# EAGLE design rapidshark-half-assed-half-h-bridge-mk-1.4 (EAGLE 7.5.0)
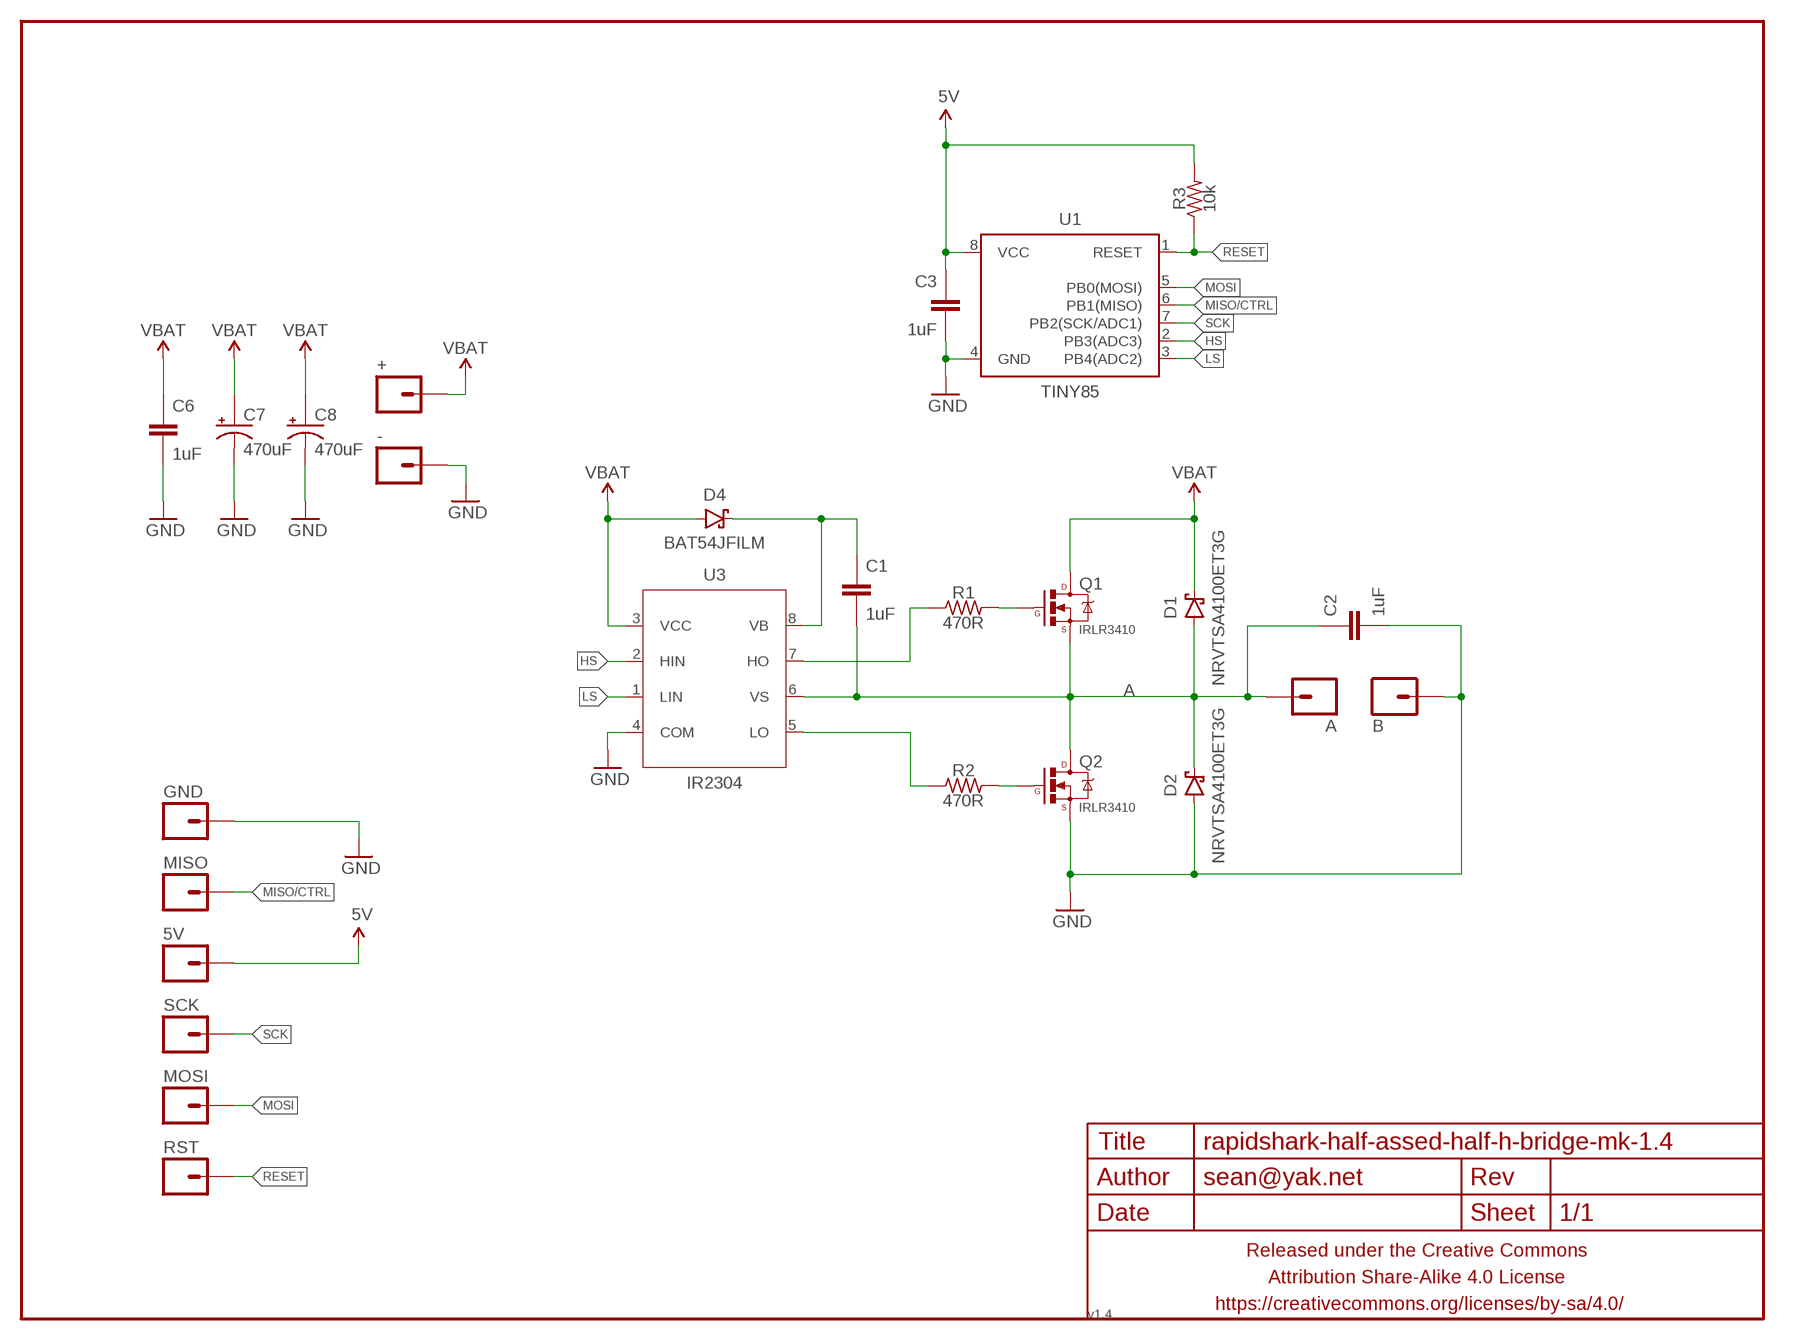
[diagram p0: schematic, sheet 1]

## Parts
5V  M01PTH-0.9MM  [1X01-0.9MM]
+  M01PTH-1.4MM  [1X01-1.4MM-CIR]
-  M01PTH-1.4MM  [1X01-1.4MM-CIR]
A  M01PTH-1.4MM  [1X01-1.4MM-CIR]
B  M01PTH-1.4MM  [1X01-1.4MM-CIR]
C1  1uF  CAPACITOR-CERAMICC0603-TIGHTER  [C0603-TIGHTER]
C2  1uF  CAPACITOR-CERAMICC0603-TIGHTER  [C0603-TIGHTER]
C3  1uF  CAPACITOR-CERAMICC0603-TIGHTER  [C0603-TIGHTER]
C6  1uF  CAPACITOR-CERAMICC0603-TIGHTER  [C0603-TIGHTER]
C7  470uF  CAPACITOR-POLARIZEDE5-10.5  [E5-10,5]
C8  470uF  CAPACITOR-POLARIZEDE5-10.5  [E5-10,5]
D1  NRVTSA4100ET3G  DIODE-SCHOTTKYSMA  [SMA-DIODE-SCHOTTKY]
D2  NRVTSA4100ET3G  DIODE-SCHOTTKYSMA  [SMA-DIODE-SCHOTTKY]
D4  BAT54JFILM  DIODE-SCHOTTKYSOD323  [SOD323-SCHOTTKY]
FRAME1  FRAME-LETTERNO_PACKAGE  [DUMMY]
GND  M01PTH-0.9MM  [1X01-0.9MM]
MISO  M01PTH-0.9MM  [1X01-0.9MM]
MOSI  M01PTH-0.9MM  [1X01-0.9MM]
Q1  IRLR3410  MOSFET-NCHANNELFDD8780  [DPAK]
Q2  IRLR3410  MOSFET-NCHANNELFDD8780  [DPAK]
R1  470R  RESISTORR0603-TIGHTER  [R0603-TIGHTER]
R2  470R  RESISTORR0603-TIGHTER  [R0603-TIGHTER]
R3  10k  RESISTORR0603-TIGHTER  [R0603-TIGHTER]
RST  M01PTH-0.9MM  [1X01-0.9MM]
SCK  M01PTH-0.9MM  [1X01-0.9MM]
U1  TINY85  ATTINY45TINY85-20-SOICW  [SO08-EIAJ]
U3  IR2304  IR2304SSOIC  [SO08]

## Nets
5V: 5V.1 C3.1 R3.2 U1.8(VCC)
A: A.P$1 C1.2 C2.1 D1.A D2.C Q1.3(S) Q2.4(D) U3.6(VS)
GND: -.P$1 B.P$1 C2.2 C3.2 C6.2 C7.- C8.- D2.A GND.1 Q2.3(S) U1.4(GND) U3.4(COM)
HS: U1.2(PB3(ADC3)) U3.2(HIN)
LS: U1.3(PB4(ADC2)) U3.1(LIN)
MISO/CTRL: MISO.1 U1.6(PB1(MISO))
MOSI: MOSI.1 U1.5(PB0(MOSI))
N$1: Q1.1(G) R1.2
N$2: Q2.1(G) R2.2
N$3: R1.1 U3.7(HO)
N$4: R2.1 U3.5(LO)
N$5: C1.1 D4.C U3.8(VB)
RESET: R3.1 RST.1 U1.1(RESET)
SCK: SCK.1 U1.7(PB2(SCK/ADC1))
VBAT: +.P$1 C6.1 C7.+ C8.+ D1.C D4.A Q1.4(D) U3.3(VCC)

## Library data of the parts
5V + - A B GND MISO MOSI RST SCK = a_parts:M01: Header 1 Standard 1-pin 0.1" header. Use with straight break away headers (SKU : PRT-00116), right angle break away headers (PRT-00553), swiss pins (PRT-00743), machine pins (PRT-00117), and female headers (PRT-00115).
C1-C3 C6 = a_parts:CAPACITOR-CERAMIC: CAPACITOR, European symbol
C7 C8 = a_parts:CAPACITOR-POLARIZED: POLARIZED CAPACITOR, American symbol
D1 D2 D4 = a_parts:DIODE-SCHOTTKY: Schottky diodes in SFE's production catalog BAT20J 1A 23V 0.62Vf RB751 120mA 40V 0.37Vf PMEG4005EJ 0.5A 40V 0.42Vf MBRA140 1A 40V 0.5Vf B340A 3A 40V SMA
FRAME1 = A_butts:FRAME-LETTER: Schematic Frame Standard 8.5x11 US Letter frame; DESIGNER: sean@yak.net; VERSION: v1.4
Q1 Q2 = a_parts:MOSFET-NCHANNEL: Common NMOSFET Parts MFG P/N Store ID Prod ID FDD8780 TRANS-09984 SI7820DN TRANS-11055 FDS6630A IC-08089 2N7002PW TRANS-11151 FQP30N06L COM-10213 TRANS-10060 BSS123LT1G TRANS-08345 BSS138 TRANS-00830 BS170 2N7000; PROD_ID: TRANS-09984
R1-R3 = a_parts:RESISTOR: RESISTOR, American symbol
U1 = a_parts:ATTINY45: Atmel 8-pin 2/4/8kB flash uC; PROD_ID: IC-09092; VALUE: Tiny85-20-SMT
U3 = a_parts:IR2304S

## Board
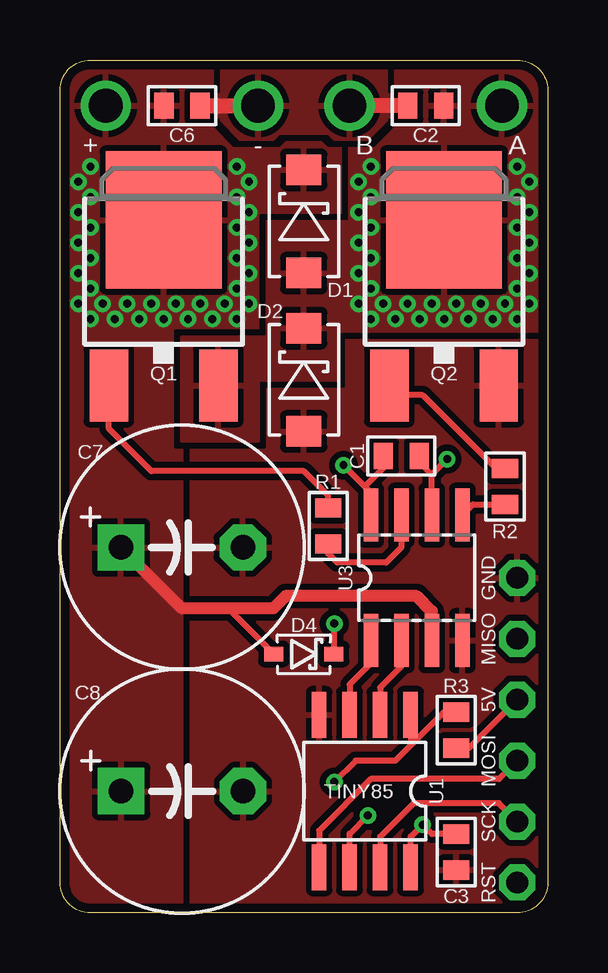
[diagram p1: board, top side]
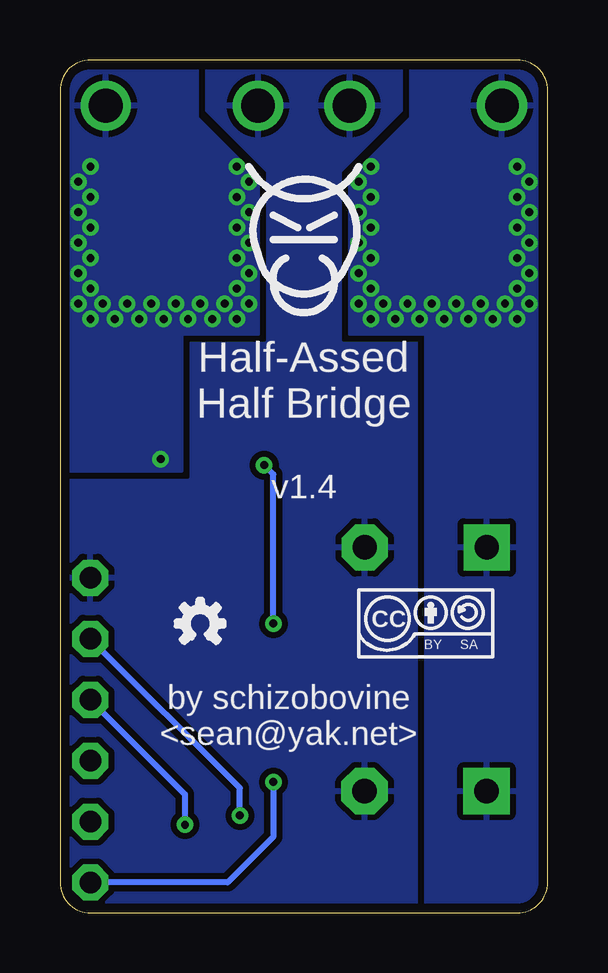
[diagram p2: board, bottom side, seen from below]

Size 20.32 x 35.56 mm. Coordinates in mm from the lower left corner, seen from the top.
Outline: 1.27,35.56 19.05,35.56 arc-90 20.32,34.29 20.32,1.27 arc-90 19.05,0 1.27,0 arc-90 0,1.27 0,34.29 arc-90 1.27,35.56
Copper layers (1*16): Top 0.0356mm / dielectric 1.5011mm / Bottom 0.0356mm
Design rules "LaenPCBOrder_2": minimum track width 6mil, minimum drill 13mil, track to track 6mil, track to pad 6mil, pad to pad 6mil, via to via 6mil, smd to smd 6mil, copper to edge 15mil, drill to drill 6mil, minimum pad ring 7mil, minimum via ring 7mil, stop-mask expansion 3mil, vias tented up to drill 20mil, thermal gap 10mil

### Footprints (pad centres in the part's own frame; a part is rotated, then mirrored left to right if it is on the bottom)
1X01-0.9MM = drill 0.9 pad 1.5 octagon: 1 0,0
1X01-1.4MM-CIR = drill 1.4 pad 2.1: P$1 0,0
C0603-TIGHTER = smd 0.8 x 1.1: 1 -0.75,0; 2 0.75,0
E5-10,5 = drill 1.016 pad 1.93 square: + -2.54,0 | drill 1.016 pad 1.93 octagon: - 2.54,0
SMA-DIODE-SCHOTTKY = smd 1.27 x 1.47: A -2.15,0; C 2.15,0
SOD323-SCHOTTKY = smd 0.8 x 0.6: A -1.25,0; C 1.25,0
DPAK = smd 1.6 x 3: 1 -2.28,-5.31; 3 2.28,-5.31 | smd 4.826 x 5.715: 4 0,1.588
R0603-TIGHTER = smd 0.8 x 1.1: 1 -0.75,0; 2 0.75,0
SO08-EIAJ = smd 0.61 x 1.905: 1 -1.905,-3.175; 2 -0.635,-3.175; 3 0.635,-3.175; 4 1.905,-3.175; 5 1.905,3.175; 6 0.635,3.175; 7 -0.635,3.175; 8 -1.905,3.175
SO08 = smd 0.61 x 2.21: 1 -1.905,-2.616; 2 -0.635,-2.616; 3 0.635,-2.616; 4 1.905,-2.616; 5 1.905,2.616; 6 0.635,2.616; 7 -0.635,2.616; 8 -1.905,2.616

### Placement (x,y rotation side)
5V  19.05,8.89 90 top
+  1.91,33.66 0 top
-  8.26,33.66 0 top
A  18.41,33.66 0 top
B  12.06,33.66 0 bottom
C1  14.22,19.05 0 top
C2  15.24,33.66 180 top
C3  16.51,2.54 270 top
C6  5.08,33.66 0 top
C7  5.08,15.24 0 top
C8  5.09,5.08 0 top
D1  10.16,28.83 90 top
D2  10.16,22.23 90 top
D4  10.16,10.79 0 top
FRAME1  0,0 0 top
GND  19.05,13.97 90 top
MISO  19.05,11.43 90 top
MOSI  19.05,6.35 90 top
Q1  4.32,27.3 0 top
Q2  16,27.3 0 top
R1  11.18,16.13 90 top
R2  18.54,17.78 90 top
R3  16.51,7.62 270 top
RST  19.05,1.27 90 top
SCK  19.05,3.81 90 top
U1  12.7,5.08 180 top
U3  14.86,13.97 0 top
U$1  [COW_SMALL_NOTEXT]  10.16,28.57 0 bottom
U$2  [CC-BY-SA-4.0-NO-URL]  5.08,12.06 0 bottom
U$3  [OSHWLOGO_TINY_SILKONLY]  14.48,12.06 0 bottom

### Tracks (layer width: path | path; a pad name or v marks a point on that pad's centre or on a via)
5V  (via drill 0.33)
  Top 0.254: R3.2 17.03,6.87 5V.1 | U1.8 14.61,3.17 v15.11,3.68 15.51,3.29 C3.1
  Bottom 0.254: 5V.1 15.11,4.95 v15.11,3.68
A  (via drill 0.33)
  Top 0.254: C1.2 14.99,19.04 14.99,18.8 15.49,18.29 | U3.6 15.49,18.29 | 15.49,18.29 v16.13,18.92
  other vias: 12.95,26.04 12.45,26.67 18.03,24.77 17.53,25.4 12.45,27.94 12.45,29.21 12.45,30.48 12.95,27.3 12.95,28.57 12.95,29.84 12.95,31.11 12.45,25.4 12.95,24.77 13.46,25.4 13.97,24.77 14.48,25.4 14.99,24.77 15.49,25.4 16,24.77 16.51,25.4 17.02,24.77 18.54,25.4 19.05,24.77 19.56,25.4 19.56,26.67 19.56,27.94 19.56,29.21 19.56,30.48 19.05,26.04 19.05,27.3 19.05,28.57 19.05,29.84 19.05,31.11
  pour Top (isolate 0.254, rank 4): 12.06,35.56 12.06,28.83 8.64,28.83 8.64,24 5.08,24 5.08,19.68 8.26,19.68 8.26,22.23 11.56,22.23 11.56,24.26 20.32,24.26 20.32,34.29 arc90 19.05,35.56
  pour Bottom (isolate 0.254, rank 5): 14.61,35.56 19.05,35.56 arc-90 20.32,34.29 20.32,18.41 15.24,18.41 15.24,24.13 12.06,24.13 12.06,30.61 14.61,33.15
GND
  Top 0.635: C6.2 -.P$1 | C2.2 B.P$1
  pour Bottom (isolate 0.254, rank 6): 20.32,34.29 20.32,1.27 arc-90 19.05,0 1.27,0 arc-90 0,1.27 0,34.29 arc-90 1.27,35.56 19.05,35.56 arc-90
  pour Top (rank 2): 6.73,35.56 6.73,33.02 7.49,32.26 8.89,32.26 9.14,32.51 11.18,32.51 11.43,32.26 12.83,32.26 13.59,33.02 13.59,35.56
  pour Top (isolate 0.254, rank 6): 0,34.29 0,1.27 arc90 1.27,0 19.05,0 arc90 20.32,1.27 20.32,34.29 arc90 19.05,35.56 1.27,35.56 arc90
HS
  Top 0.254: U3.2 14.22,10.29 13.34,9.4 U1.2
LS
  Top 0.254: U3.1 12.95,10.41 12.06,9.53 U1.3
MISO/CTRL  (via drill 0.33)
  Top 0.254: U1.6 12.06,3.3 v12.83,4.06
  Bottom 0.254: v12.83,4.06 12.83,5.21 MISO.1
MOSI
  Top 0.254: MOSI.1 18.29,5.59 12.95,5.59 10.79,3.43 U1.5
N$1
  Top 0.254: R1.2 11.18,17.4 10.16,18.41 3.81,18.41 2.04,20.19 Q1.1
N$2
  Top 0.254: Q2.1 14.13,21.59 15.11,21.59 18.16,18.54 18.53,18.54 R2.2
N$3
  Top 0.254: U3.7 14.22,15.24 13.59,14.61 11.56,14.61 11.18,14.99 R1.1
N$4
  Top 0.254: U3.5 17.21,17.03 R2.1
N$5  (via drill 0.33)
  Top 0.254: D4.C 11.43,10.81 v11.43,12.06 | v11.81,18.67 12.7,17.78 | 12.7,17.78 13.47,18.55 C1.1 | 12.7,17.78 12.95,17.53 U3.8
  Bottom 0.254: v11.43,12.06 11.43,18.29 v11.81,18.67
RESET  (via drill 0.33)
  Top 0.254: U1.1 14.61,6.99 | 14.61,6.99 13.97,6.35 12.32,6.35 v11.43,5.46 | R3.1 15.99,8.37 14.61,6.99
  Bottom 0.254: v11.43,5.46 11.43,3.17 13.34,1.27 RST.1
SCK
  Top 0.254: SCK.1 18.29,4.57 14.73,4.57 13.34,3.17 U1.7
VBAT  (via drill 0.33)
  Top 0.254: D4.A 7,12.7 6.99,12.7
  Top 0.508: U3.3 15.49,12.57 14.86,13.21 9.4,13.21 8.89,12.7 6.99,12.7 5.08,12.7 C7.+
  other vias: 1.78,25.4 2.79,25.4 3.81,25.4 4.83,25.4 5.84,25.4 1.27,24.77 2.29,24.77 3.3,24.77 4.32,24.77 5.33,24.77 6.35,24.77 1.27,26.04 1.27,27.3 1.27,28.57 1.27,29.84 1.27,31.11 6.86,25.4 7.37,24.77 7.87,25.4 7.37,26.04 0.76,26.67 0.76,27.94 0.76,29.21 0.76,30.48 7.37,31.11 0.76,25.4 7.87,26.67 7.87,27.94 7.87,29.21 7.87,30.48 7.37,27.3 7.37,28.57 7.37,29.84
  pour Top (isolate 0.254, rank 5): 5.08,0 1.27,0 arc-90 0,1.27 0,34.29 arc-90 1.27,35.56 12.06,35.56 12.06,28.83 8.64,28.83 8.64,24 5.08,24
  pour Bottom (isolate 0.254, rank 5): 5.08,0 1.27,0 arc-90 0,1.27 0,34.29 arc-90 1.27,35.56 5.71,35.56 5.71,33.15 8.26,30.61 8.26,24.13 5.08,24.13

### Text on the board
bPlace: Half-Assed / Half Bridge | by schizobovine / <sean@yak.net>